# EAGLE schematic sumo2 (EAGLE 8.3.2)
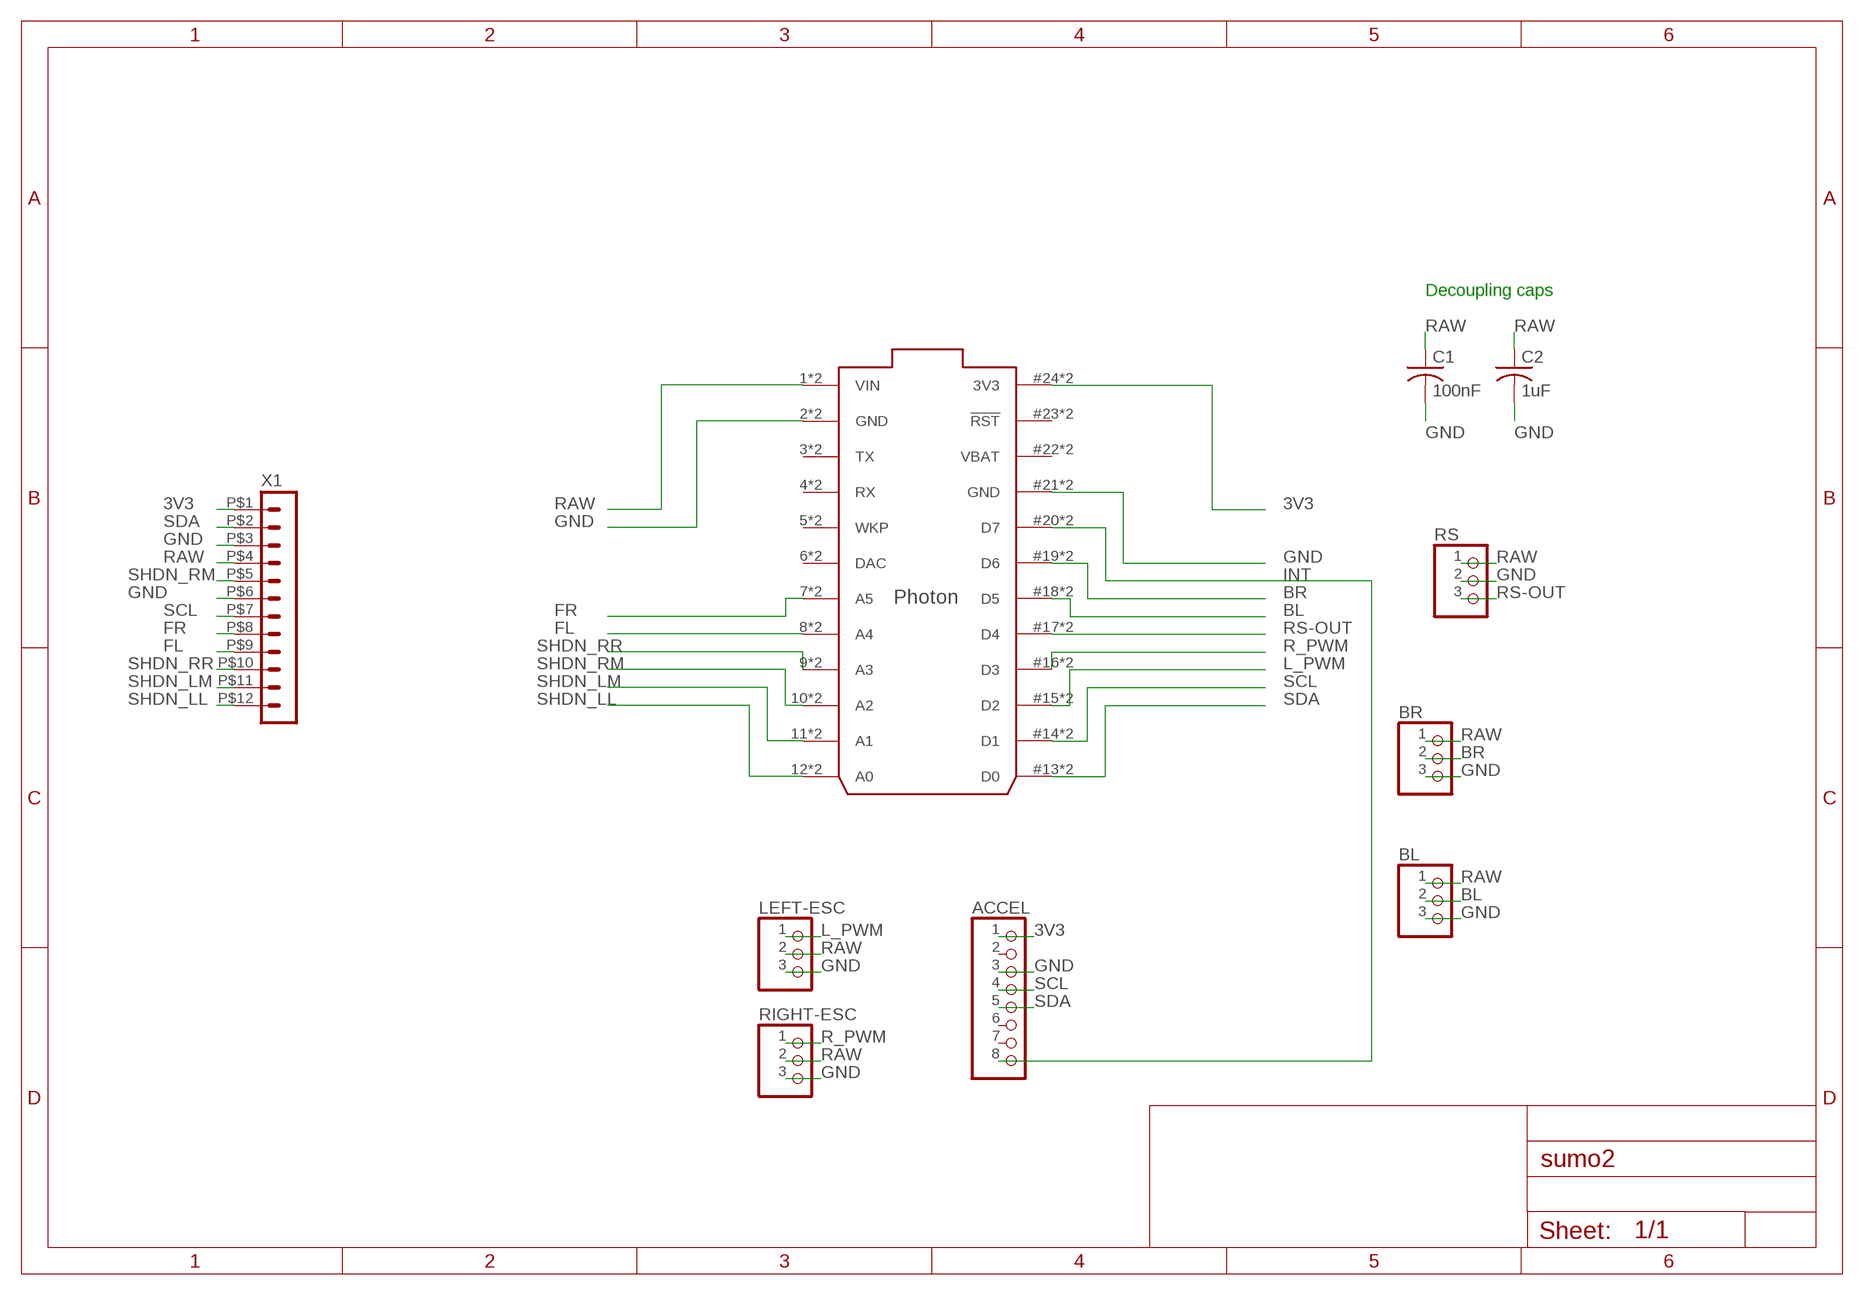
[diagram p0: schematic, sheet 1]

## Parts
ACCEL  PINHD-1X8  [1X08]
BL  PINHD-1X3  [1X03]
BR  PINHD-1X3  [1X03]
C1  100nF  C-USC0603  [C0603]
C2  1uF  C-USC0603  [C0603]
LEFT-ESC  PINHD-1X3  [1X03]
RIGHT-ESC  PINHD-1X3  [1X03]
RS  PINHD-1X3  [1X03]
U$1  PHOTON_WITH_STACKABLE_HEADERS  [PHOTON_STACKABLE]
X1  HEADER_POS12_43045-1212  [43045-1212]

## Nets
3V3: ACCEL.1 U$1.24(3V3) U$1.#24(3V3) X1.P$1
BL: BL.2 U$1.18(D5) U$1.#18(D5)
BR: BR.2 U$1.19(D6) U$1.#19(D6)
FL: U$1.8(A4) U$1.@8(A4) X1.P$9
FR: U$1.7(A5) U$1.@7(A5) X1.P$8
GND: ACCEL.3 BL.3 BR.3 C1.2 C2.2 LEFT-ESC.3 RIGHT-ESC.3 RS.2 U$1.2(GND) U$1.21(GND) U$1.#21(GND) U$1.@2(GND) X1.P$3 X1.P$6
INT: ACCEL.8 U$1.20(D7) U$1.#20(D7)
L_PWM: LEFT-ESC.1 U$1.15(D2) U$1.#15(D2)
R_PWM: RIGHT-ESC.1 U$1.16(D3) U$1.#16(D3)
RAW: BL.1 BR.1 C1.1 C2.1 LEFT-ESC.2 RIGHT-ESC.2 RS.1 U$1.1(VIN) U$1.@1(VIN) X1.P$4
RS-OUT: RS.3 U$1.17(D4) U$1.#17(D4)
SCL: ACCEL.4 U$1.14(D1) U$1.#14(D1) X1.P$7
SDA: ACCEL.5 U$1.13(D0) U$1.#13(D0) X1.P$2
SHDN_LL: U$1.12(A0) U$1.@12(A0) X1.P$12
SHDN_LM: U$1.11(A1) U$1.@11(A1) X1.P$11
SHDN_RM: U$1.10(A2) U$1.@10(A2) X1.P$5
SHDN_RR: U$1.9(A3) U$1.@9(A3) X1.P$10
Unconnected: ACCEL.2 ACCEL.6 ACCEL.7 U$1.3(TX) U$1.4(RX) U$1.5(WKP) U$1.6(DAC) U$1.23(!RST) U$1.#23(!RST) U$1.@3(TX) U$1.@4(RX) U$1.@5(WKP) U$1.@6(DAC)

## Notes on the sheet
- Decoupling caps

## Power pins joined to a net without a drawn wire
VBAT: U$1.22(VBAT) U$1.#22(VBAT)

## Library data of the parts
ACCEL = pinhead:PINHD-1X8: PIN HEADER
BL BR LEFT-ESC RIGHT-ESC RS = pinhead:PINHD-1X3: PIN HEADER
C1 C2 = rcl:C-US: CAPACITOR, American symbol
U$1 = Spark:PHOTON
X1 = con-molex-micro-fit-3_0:HEADER_POS12_?: Molex - Micro-Fit 3.0 Series connector, 3.00mm (0.118") pitch header, 12 positions.